# Altium project B&D-A Power.PrjPcb
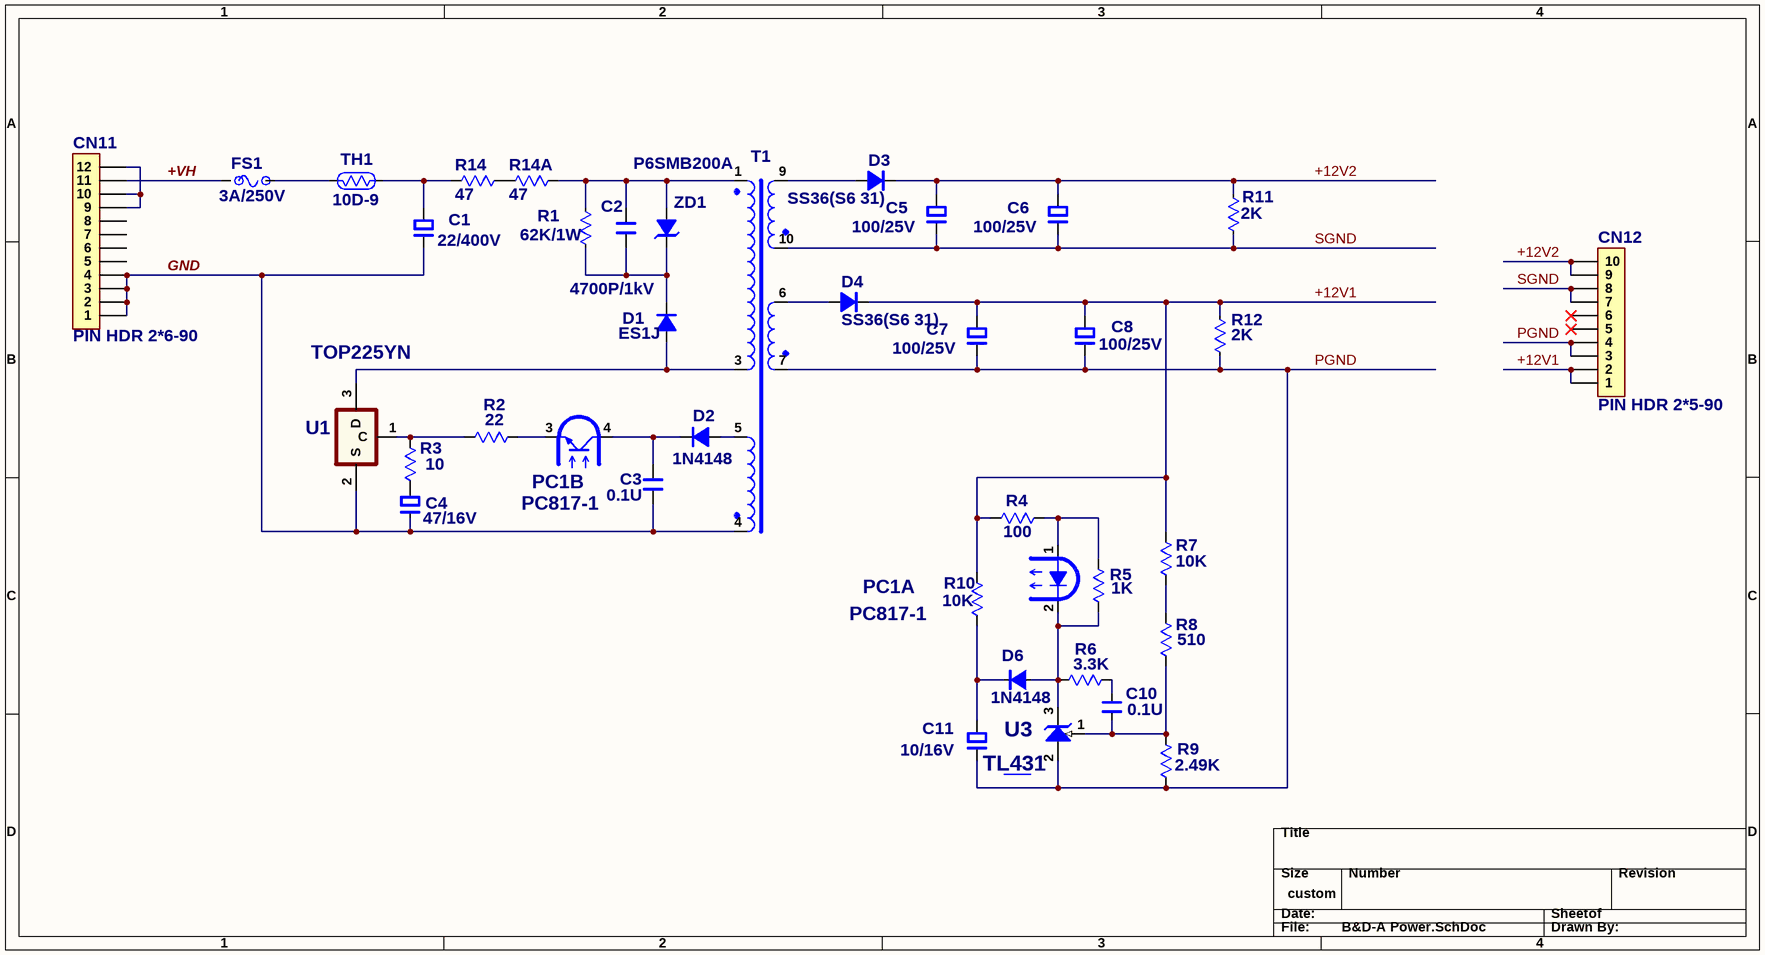
[diagram p0: B&D-A Power.SchDoc]
1 sheet, 38 parts. Net scope: global (net labels, ports and power ports of the same name join across sheets).
Board file: B&D-A Power.PcbDoc

## Sheet B&D-A Power.SchDoc
size 330 x 177 mm; SheetNumber: 0; SheetTotal: 0

### Parts
C1  22/400V  [CAP P D12.8/5.08]
C2  4700P/1kV  [CAP 7.0*3.5/5.08]
C3  0.1U  [2012(0805)-2.54]
C4  47/16V  [CAP P D8.2/3.56]
C5  100/25V  [CAP P D6.4/3.05]
C6  100/25V  [CAP P D6.4/3.05]
C7  100/25V  [CAP P D6.4/3.05]
C8  100/25V  [CAP P D6.4/3.05]
C10  0.1U  [2012(0805)-2.54]
C11  10/16V  [CAP P 3528]
CN11  PIN HDR 2*6-90  [PIN HDR 2*6-90]
CN12  PIN HDR 2*5-90  [PIN HDR 2*5-90]
D1  ES1J  [D5025]
D2  1N4148  [D3515]
D3  SS36(S6 31)  [D7060]
D4  SS36(S6 31)  [D7060]
D6  1N4148  [D3515]
FS1  3A/250V  [FUSE D8/5.08]
PC1  PC817-1  [DIP-4-340]  (parts A,B of 2)
R1  62K/1W  [RES D3.0/5.08]
R2  22  [2012(0805)-2.54]
R3  10  [2012(0805)-2.54]
R4  100  [2012(0805)-2.54]
R5  1K  [2012(0805)-2.54]
R6  3.3K  [2012(0805)-2.54]
R7  10K  [2012(0805)-2.54]
R8  510  [2012(0805)-2.54]
R9  2.49K  [2012(0805)-2.54]
R10  10K  [2012(0805)-2.54]
R11  2K  [2012(0805)-2.54]
R12  2K  [2012(0805)-2.54]
R14  47  [6432(2512)-6.6]
R14A  47  [6432(2512)-6.6]
T1  FEE-22-10  [FEE-22-10/10.4*15.7]  (value not drawn)
TH1  10D-9  [TH 9.4*4/7.62*1.52]
U1  TOP225YN  [TO-220_1]
U3  TL431  [TO-92_1]
ZD1  P6SMB200A  [DZ5035]

### Nets
+12V1: C7.1 C8.1 CN12.1 CN12.2 D4.2(K) R4.2 R7.2 R10.1 R12.2
+12V2: C5.1 C6.1 CN12.9 CN12.10 D3.2(K) R11.2
+VH: CN11.11 FS1.1
GND: C1.2 C3.2 C4.2 CN11.1 CN11.2 CN11.3 CN11.4 T1.4 U1.2(S)
PGND: C7.2 C8.2 C11.2 CN12.3 CN12.4 R9.1 R12.1 T1.7 U3.2(A)
SGND: C5.2 C6.2 CN12.7 CN12.8 R11.1 T1.10
NetC1_1: C1.1 R14.1 TH1.2
NetC2_1: C2.1 R1.1 R14A.2 T1.1 ZD1.1(A)
NetC2_2: C2.2 D1.2(K) R1.2 ZD1.2(K)
NetC3_1: C3.1 D2.2(K) PC1.4(C)
NetC4_1: C4.1 R3.2
NetC10_1: C10.1 R6.1
NetC10_2: C10.2 R8.1 R9.2 U3.1(R)
NetC11_1: C11.1 D6.2(K) R10.2
NetCN11_9: CN11.9 CN11.10 CN11.12
NetD1_1: D1.1(A) T1.3 U1.3(D)
NetD2_1: D2.1(A) T1.5
NetD3_1: D3.1(A) T1.9
NetD4_1: D4.1(A) T1.6
NetD6_1: D6.1(A) PC1.2(K) R5.1 R6.2 U3.3(K)
NetFS1_2: FS1.2 TH1.1
NetPC1_1: PC1.1(A) R4.1 R5.2
NetPC1_3: PC1.3(E) R2.1
NetR2_2: R2.2 R3.1 U1.1(C)
NetR7_1: R7.1 R8.2
NetR14_2: R14.2 R14A.1

Not connected (* = marked no-connect by the designer): CN11 5 6 7 8; CN12 5* 6*

### Library data of the parts
C1 C5-C8 = CAP P_3: Electrolytic Capacitor
C2 C3 = CAP_3: Capacitor
C4 = CAP P_2: Electrolytic Capacitor
C10 = CAP_2: Capacitor
C11 = CAP P3_V.3: Electrolytic Capacitor
CN11 = CON12: Connector
CN12 = CON10: Connector
D1-D4 = DIODE(AK)_2: Diode
D6 = DIODE_1: Diode
FS1 = F.S_1: FUSE
PC1 = TLP521-1_2
R1 R11 R12 = RES_1: Resistor
R2-R10 R14 R14A = RES_2: Resistor
T1 = TRANS8-4_1
TH1 = TH_2: Thermistor
U1 = TOP100Y_1: 3-Terminal Positive Voltage Regulator
U3 = TL431_2: Programmable Voltage Reference
ZD1 = ZD_2: Zener Diode